# EAGLE design GUI_Switches (EAGLE 9.4.1)
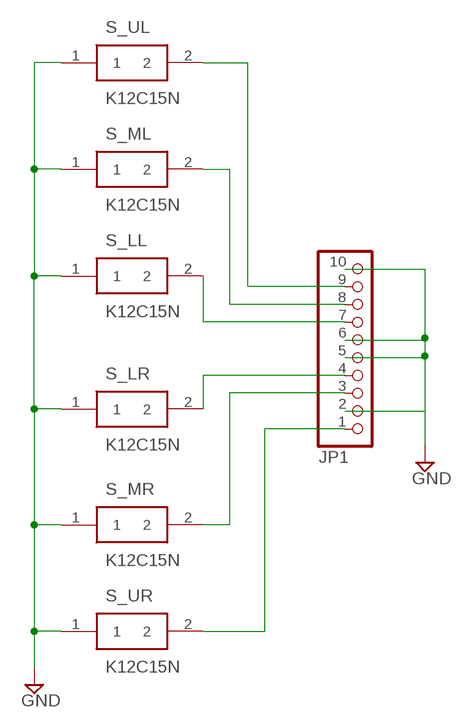
[diagram p0: schematic, sheet 1]

## Parts
JP1  PINHD-1X10/90  [1X10/90]
S_LL  K12C15N  [K12C15N]
S_LR  K12C15N  [K12C15N]
S_ML  K12C15N  [K12C15N]
S_MR  K12C15N  [K12C15N]
S_UL  K12C15N  [K12C15N]
S_UR  K12C15N  [K12C15N]

## Nets
GND: JP1.2 JP1.5 JP1.6 JP1.10 S_LL.1 S_LR.1 S_ML.1 S_MR.1 S_UL.1 S_UR.1
N$1: JP1.7 S_LL.2
N$2: JP1.9 S_UL.2
N$4: JP1.4 S_LR.2
N$5: JP1.3 S_MR.2
N$6: JP1.1 S_UR.2
N$7: JP1.8 S_ML.2

## Library data of the parts
JP1 = pinhead:PINHD-1X10: PIN HEADER
S_LL S_LR S_ML S_MR S_UL S_UR = SamacSys_Parts:K12C15N: IP67 SPST-NO Keyboard Switch, 100 mA@ 30 V dc, -40 +85C Source: Datasheet <http://docs-emea.rs-online.com/webdocs/1271/0900766b812712fb.pdf>; DESCRIPTION: IP67 SPST-NO Keyboard Switch, 100 mA@ 30 V dc, -40 +85C; HEIGHT: mm; MANUFACTURER_NAME: C & K COMPONENTS; MANUFACTURER_PART_NUMBER: K12C15N; MOUSER_PART_NUMBER: 611-K12C15N; MOUSER_PRICE-STOCK: https://www.mouser.com/Search/Refine.aspx?Keyword=611-K12C15N; RS_PART_NUMBER: 7874858; RS_PRICE-STOCK: http://uk.rs-online.com/web/p/products/7874858

## Board
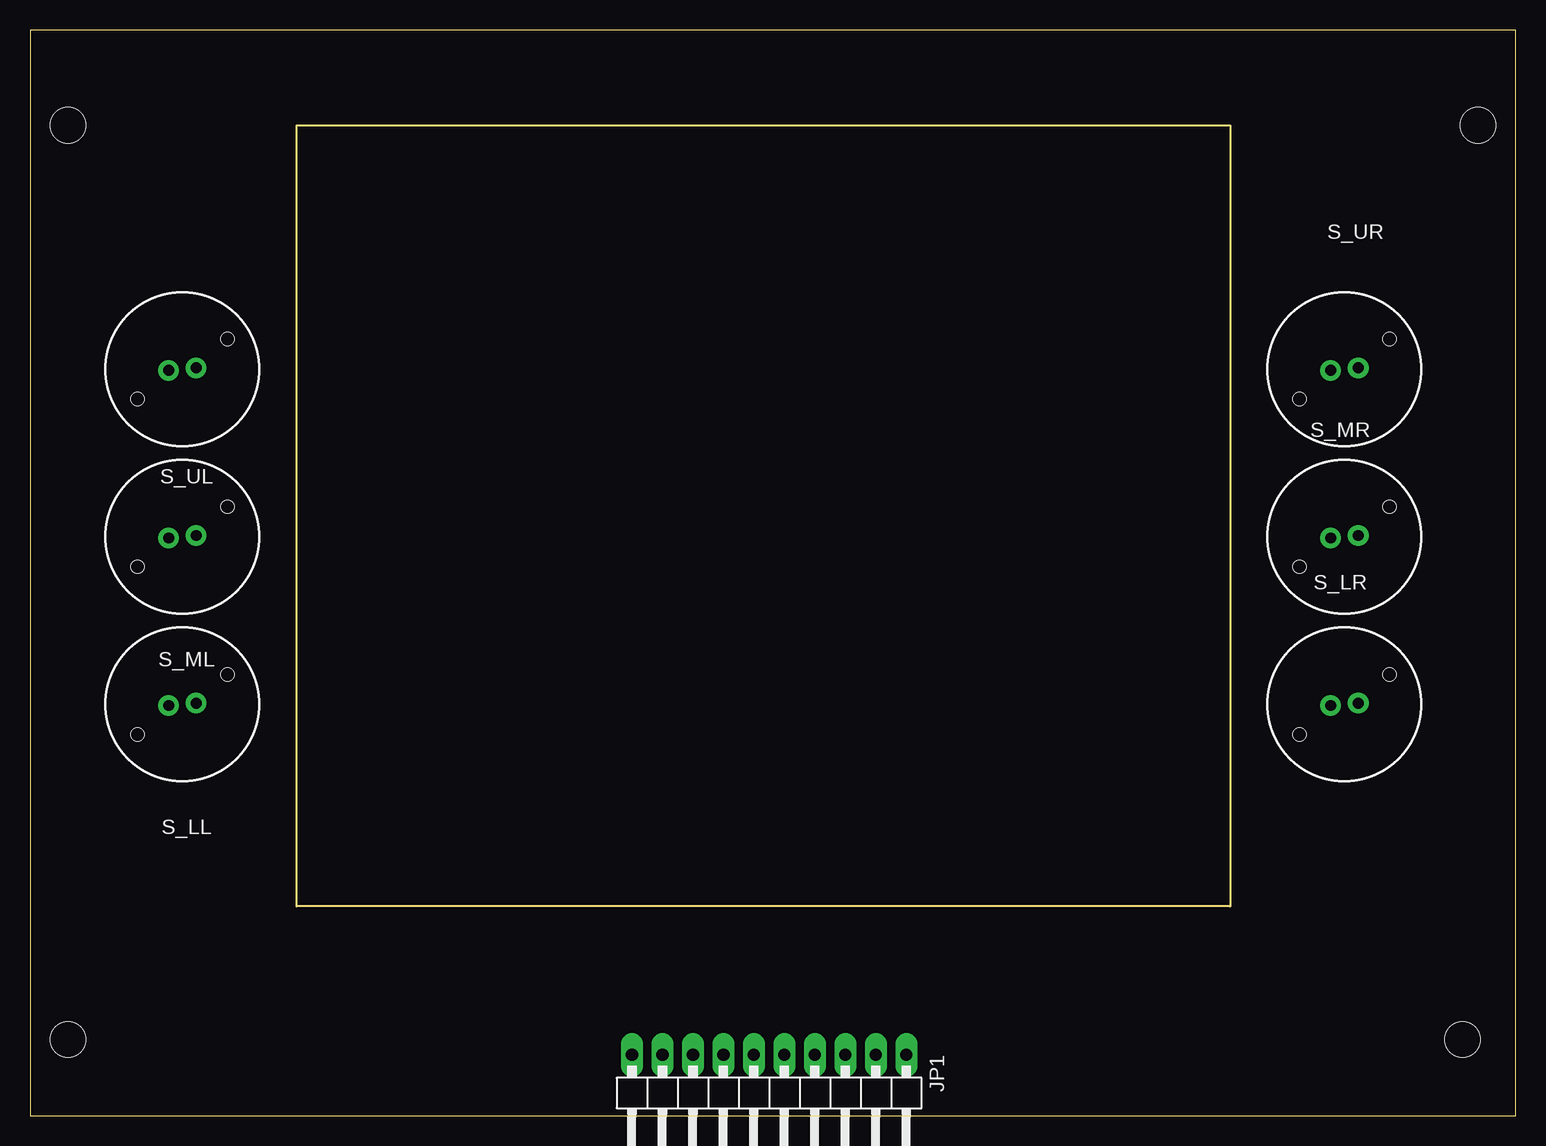
[diagram p1: board, top side]
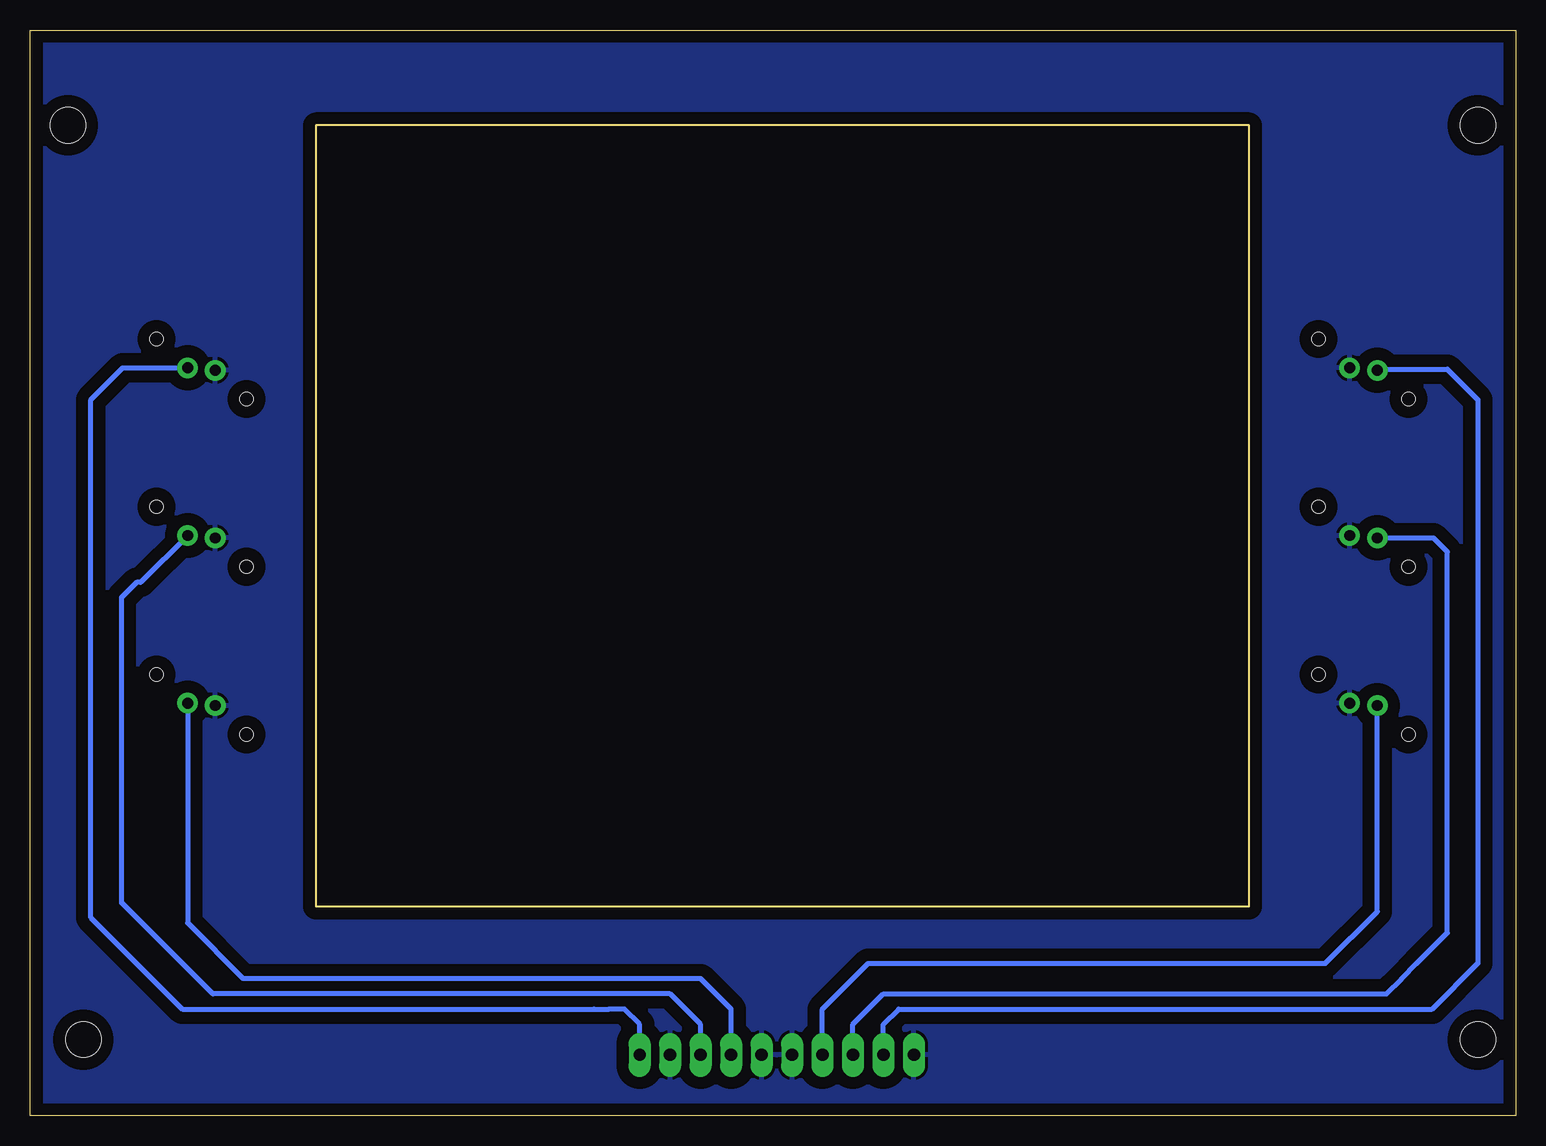
[diagram p2: board, bottom side, seen from below]

Size 123.83 x 90.49 mm. Coordinates in mm from the lower left corner, seen from the top.
Outline: 0,0 123.83,0 123.83,90.49 0,90.49 0,0
Outline: 22.22,82.55 100.01,82.55 100.01,17.46 22.22,17.46 22.22,82.55
Copper layers (1*16): Top 0.035mm / dielectric 1.5mm / Bottom 0.035mm
Design rules "SPIS_LPKF_16mil": minimum track width 10mil, minimum drill 24mil, track to track 16mil, track to pad 16mil, pad to pad 16mil, via to via 16mil, smd to smd 16mil, copper to edge 40mil, drill to drill 8mil, minimum pad ring 16mil, minimum via ring 16mil, stop-mask expansion 4mil, vias tented up to drill 0mil, thermal gap 10mil
Holes 2.95 mm at 3.17,82.55 120.65,82.55 119.38,6.35 3.17,6.35

### Footprints (pad centres in the part's own frame; a part is rotated, then mirrored left to right if it is on the bottom)
1X10/90 = drill 1.016 long: 1 -11.43,-3.81; 2 -8.89,-3.81; 3 -6.35,-3.81; 4 -3.81,-3.81; 5 -1.27,-3.81; 6 1.27,-3.81; 7 3.81,-3.81; 8 6.35,-3.81; 9 8.89,-3.81; 10 11.43,-3.81
K12C15N = drill 0.9 pad 1.4: 1 -1.15,-0.1; 2 1.15,0.1 | hole 1.1: -3.75,-2.5; 3.75,2.5

### Placement (x,y rotation side)
JP1  61.59,1.27 180 top
S_LL  12.7,34.29 180 top
S_LR  109.54,34.29 0 top
S_ML  12.7,48.26 180 top
S_MR  109.54,48.26 0 top
S_UL  12.7,62.23 180 top
S_UR  109.54,62.23 0 top

### Tracks (layer width: path | path; a pad name or v marks a point on that pad's centre or on a via)
GND
  pour Bottom (isolate 1.016): 122.56,90.17 122.56,0 0,0 0,90.17
N$1
  Bottom 0.406: S_LL.2 11.55,17.02 15.88,12.7 53.98,12.7 57.79,8.89 JP1.7
N$2
  Bottom 0.406: S_UL.2 11.45,62.23 5.72,62.23 3.17,59.69 3.17,12.7 6.99,8.89 51.44,8.89 52.71,7.62 JP1.9
N$4
  Bottom 0.406: S_LR.2 110.69,16.07 106.05,11.43 67.95,11.43 65.41,8.89 JP1.4
N$5
  Bottom 0.406: JP1.3 67.95,7.62 70.48,10.16 108.59,10.16 116.2,17.78 116.2,43.18 114.94,44.45 114.6,44.45 S_MR.2
N$6
  Bottom 0.406: S_UR.2 116.11,62.33 118.75,59.69 118.75,16.51 111.12,8.89 76.84,8.89 75.56,8.89 74.3,8.89 73.03,7.62 JP1.1
N$7
  Bottom 0.406: S_ML.2 6.89,48.16 5.72,46.99 5.72,15.24 8.25,12.7 9.52,11.43 10.8,10.16 52.71,10.16 55.25,7.62 JP1.8